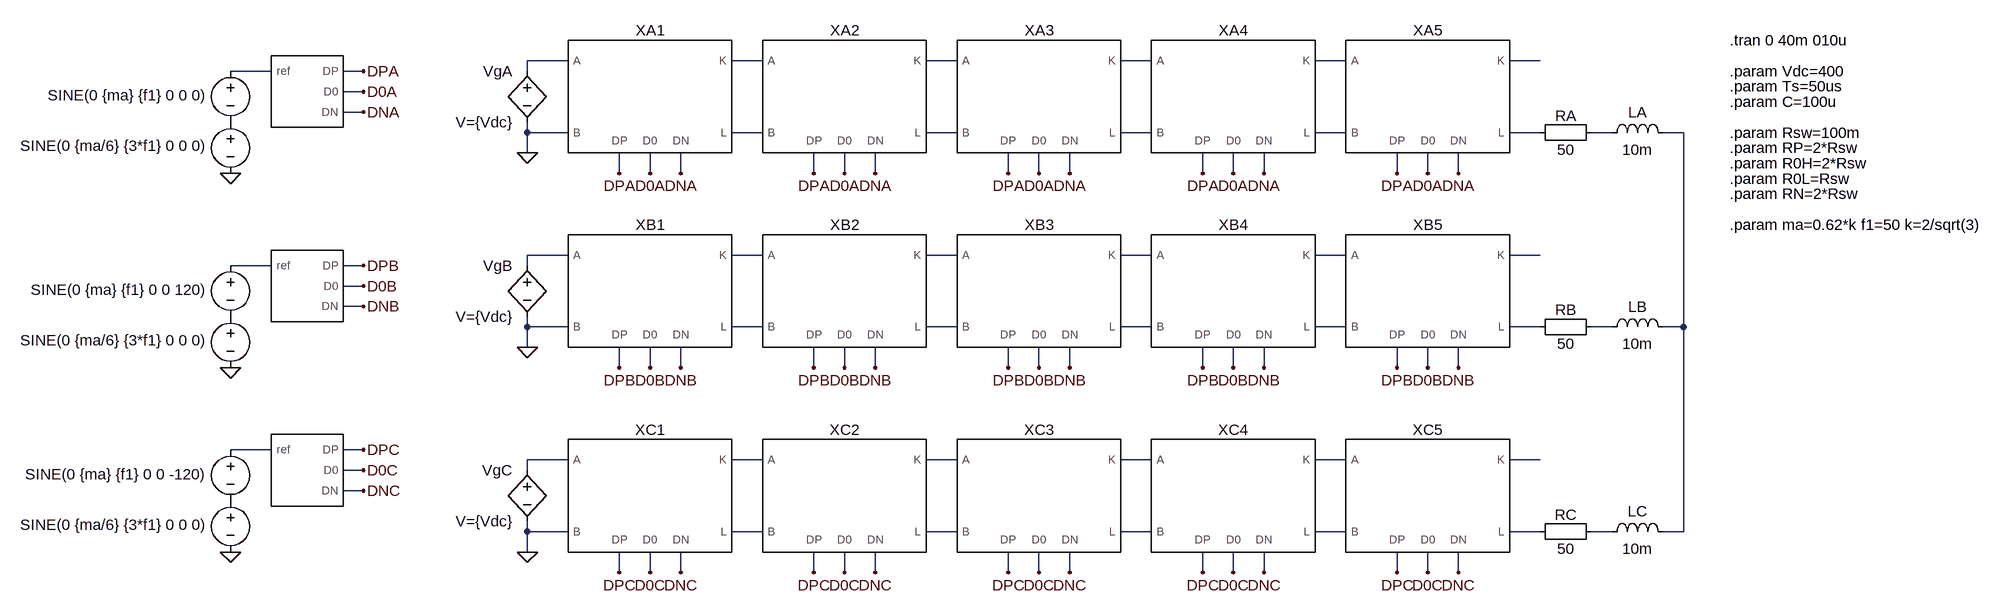
[diagram p0: schematic PN_voltage_drop_propagation.asc]
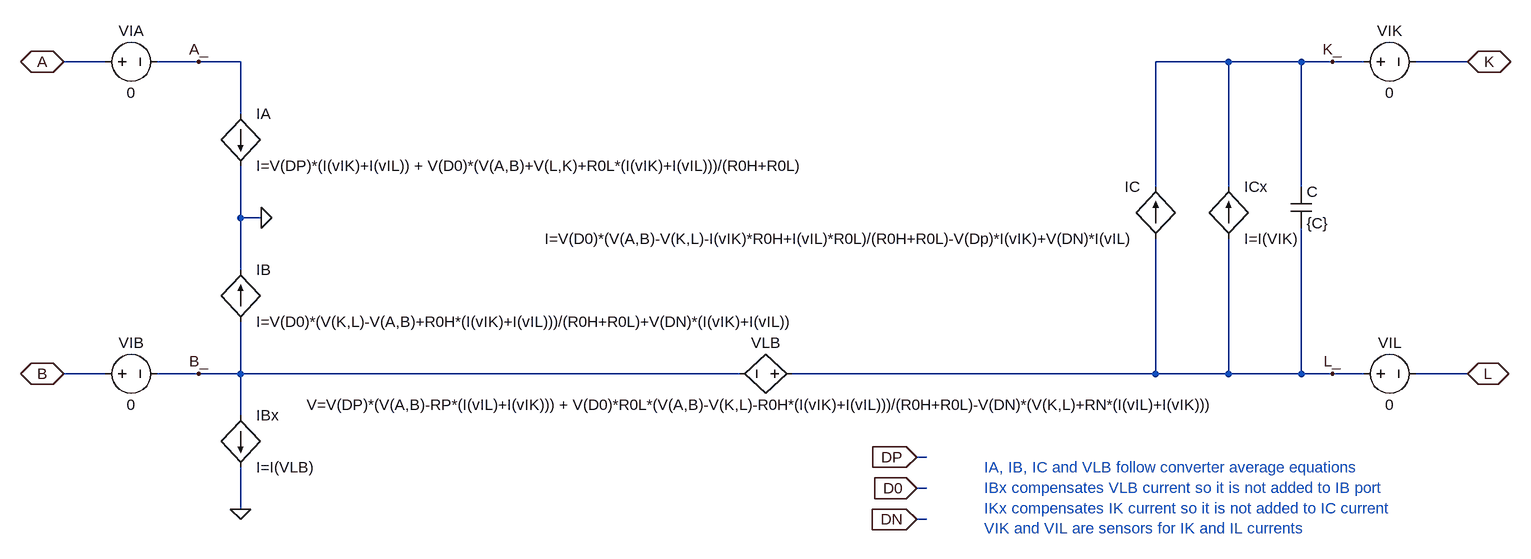
[diagram p1: sub-circuit pn_average_model.asc]
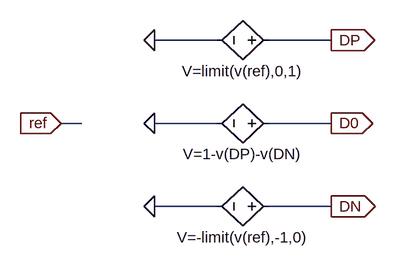
[diagram p2: sub-circuit pn_average_modulator.asc]
PN_voltage_drop_propagation.asc, the LTspice schematic file:
Version 4
SHEET 1 4356 1844
WIRE 1008 -1488 944 -1488
WIRE 1312 -1488 1264 -1488
WIRE 1616 -1488 1568 -1488
WIRE 1920 -1488 1872 -1488
WIRE 2224 -1488 2176 -1488
WIRE 2528 -1488 2480 -1488
WIRE 544 -1472 480 -1472
WIRE 688 -1472 656 -1472
WIRE 944 -1472 944 -1488
WIRE 688 -1440 656 -1440
WIRE 688 -1408 656 -1408
WIRE 944 -1376 944 -1392
WIRE 1008 -1376 944 -1376
WIRE 1312 -1376 1264 -1376
WIRE 1616 -1376 1568 -1376
WIRE 1920 -1376 1872 -1376
WIRE 2224 -1376 2176 -1376
WIRE 2528 -1376 2480 -1376
WIRE 2640 -1376 2608 -1376
WIRE 2752 -1376 2720 -1376
WIRE 944 -1344 944 -1376
WIRE 1088 -1312 1088 -1344
WIRE 1136 -1312 1136 -1344
WIRE 1184 -1312 1184 -1344
WIRE 1392 -1312 1392 -1344
WIRE 1440 -1312 1440 -1344
WIRE 1488 -1312 1488 -1344
WIRE 1696 -1312 1696 -1344
WIRE 1744 -1312 1744 -1344
WIRE 1792 -1312 1792 -1344
WIRE 2000 -1312 2000 -1344
WIRE 2048 -1312 2048 -1344
WIRE 2096 -1312 2096 -1344
WIRE 2304 -1312 2304 -1344
WIRE 2352 -1312 2352 -1344
WIRE 2400 -1312 2400 -1344
WIRE 1008 -1184 944 -1184
WIRE 1312 -1184 1264 -1184
WIRE 1616 -1184 1568 -1184
WIRE 1920 -1184 1872 -1184
WIRE 2224 -1184 2176 -1184
WIRE 2528 -1184 2480 -1184
WIRE 544 -1168 480 -1168
WIRE 688 -1168 656 -1168
WIRE 944 -1168 944 -1184
WIRE 688 -1136 656 -1136
WIRE 688 -1104 656 -1104
WIRE 944 -1072 944 -1088
WIRE 1008 -1072 944 -1072
WIRE 1312 -1072 1264 -1072
WIRE 1616 -1072 1568 -1072
WIRE 1920 -1072 1872 -1072
WIRE 2224 -1072 2176 -1072
WIRE 2528 -1072 2480 -1072
WIRE 2640 -1072 2608 -1072
WIRE 2752 -1072 2752 -1376
WIRE 2752 -1072 2720 -1072
WIRE 944 -1040 944 -1072
WIRE 1088 -1008 1088 -1040
WIRE 1136 -1008 1136 -1040
WIRE 1184 -1008 1184 -1040
WIRE 1392 -1008 1392 -1040
WIRE 1440 -1008 1440 -1040
WIRE 1488 -1008 1488 -1040
WIRE 1696 -1008 1696 -1040
WIRE 1744 -1008 1744 -1040
WIRE 1792 -1008 1792 -1040
WIRE 2000 -1008 2000 -1040
WIRE 2048 -1008 2048 -1040
WIRE 2096 -1008 2096 -1040
WIRE 2304 -1008 2304 -1040
WIRE 2352 -1008 2352 -1040
WIRE 2400 -1008 2400 -1040
WIRE 544 -880 480 -880
WIRE 688 -880 656 -880
WIRE 1008 -864 944 -864
WIRE 1312 -864 1264 -864
WIRE 1616 -864 1568 -864
WIRE 1920 -864 1872 -864
WIRE 2224 -864 2176 -864
WIRE 2528 -864 2480 -864
WIRE 688 -848 656 -848
WIRE 944 -848 944 -864
WIRE 688 -816 656 -816
WIRE 944 -752 944 -768
WIRE 1008 -752 944 -752
WIRE 1312 -752 1264 -752
WIRE 1616 -752 1568 -752
WIRE 1920 -752 1872 -752
WIRE 2224 -752 2176 -752
WIRE 2528 -752 2480 -752
WIRE 2640 -752 2608 -752
WIRE 2752 -752 2752 -1072
WIRE 2752 -752 2720 -752
WIRE 944 -720 944 -752
WIRE 1088 -688 1088 -720
WIRE 1136 -688 1136 -720
WIRE 1184 -688 1184 -720
WIRE 1392 -688 1392 -720
WIRE 1440 -688 1440 -720
WIRE 1488 -688 1488 -720
WIRE 1696 -688 1696 -720
WIRE 1744 -688 1744 -720
WIRE 1792 -688 1792 -720
WIRE 2000 -688 2000 -720
WIRE 2048 -688 2048 -720
WIRE 2096 -688 2096 -720
WIRE 2304 -688 2304 -720
WIRE 2352 -688 2352 -720
WIRE 2400 -688 2400 -720
FLAG 688 -1472 DPA
FLAG 688 -1440 D0A
FLAG 688 -1408 DNA
FLAG 1088 -1312 DPA
FLAG 1136 -1312 D0A
FLAG 1184 -1312 DNA
FLAG 944 -1344 0
FLAG 1088 -1008 DPB
FLAG 1136 -1008 D0B
FLAG 1184 -1008 DNB
FLAG 944 -1040 0
FLAG 1088 -688 DPC
FLAG 1136 -688 D0C
FLAG 1184 -688 DNC
FLAG 944 -720 0
FLAG 480 -1312 0
FLAG 1392 -1312 DPA
FLAG 1440 -1312 D0A
FLAG 1488 -1312 DNA
FLAG 1696 -1312 DPA
FLAG 1744 -1312 D0A
FLAG 1792 -1312 DNA
FLAG 688 -1168 DPB
FLAG 688 -1136 D0B
FLAG 688 -1104 DNB
FLAG 480 -1008 0
FLAG 688 -880 DPC
FLAG 688 -848 D0C
FLAG 688 -816 DNC
FLAG 480 -720 0
FLAG 1392 -1008 DPB
FLAG 1440 -1008 D0B
FLAG 1488 -1008 DNB
FLAG 1696 -1008 DPB
FLAG 1744 -1008 D0B
FLAG 1792 -1008 DNB
FLAG 1392 -688 DPC
FLAG 1440 -688 D0C
FLAG 1488 -688 DNC
FLAG 1696 -688 DPC
FLAG 1744 -688 D0C
FLAG 1792 -688 DNC
FLAG 2000 -1312 DPA
FLAG 2048 -1312 D0A
FLAG 2096 -1312 DNA
FLAG 2304 -1312 DPA
FLAG 2352 -1312 D0A
FLAG 2400 -1312 DNA
FLAG 2000 -1008 DPB
FLAG 2048 -1008 D0B
FLAG 2096 -1008 DNB
FLAG 2304 -1008 DPB
FLAG 2352 -1008 D0B
FLAG 2400 -1008 DNB
FLAG 2000 -688 DPC
FLAG 2048 -688 D0C
FLAG 2096 -688 DNC
FLAG 2304 -688 DPC
FLAG 2352 -688 D0C
FLAG 2400 -688 DNC
SYMBOL bv 944 -1488 M0
SYMATTR InstName VgA
SYMATTR Value V={Vdc}
SYMBOL Misc/EuropeanResistor 2512 -1360 R270
WINDOW 0 27 56 VTop 2
WINDOW 3 5 56 VBottom 2
SYMATTR InstName RA
SYMATTR Value 50
SYMBOL ind 2624 -1360 R270
WINDOW 0 32 56 VTop 2
WINDOW 3 5 56 VBottom 2
SYMATTR InstName LA
SYMATTR Value 10m
SYMBOL PN_average_model 1136 -1440 R0
SYMATTR InstName XA1
SYMATTR SpiceLine C={C} RP={RP} R0H={R0H} R0L={R0L} RN={RN}
SYMBOL PN_average_model 1440 -1440 R0
SYMATTR InstName XA2
SYMATTR SpiceLine C={C} RP={RP} R0H={R0H} R0L={R0L} RN={RN}
SYMBOL PN_average_model 1744 -1440 R0
SYMATTR InstName XA3
SYMATTR SpiceLine C={C} RP={RP} R0H={R0H} R0L={R0L} RN={RN}
SYMBOL bv 944 -1184 M0
SYMATTR InstName VgB
SYMATTR Value V={Vdc}
SYMBOL Misc/EuropeanResistor 2512 -1056 R270
WINDOW 0 27 56 VTop 2
WINDOW 3 5 56 VBottom 2
SYMATTR InstName RB
SYMATTR Value 50
SYMBOL ind 2624 -1056 R270
WINDOW 0 32 56 VTop 2
WINDOW 3 5 56 VBottom 2
SYMATTR InstName LB
SYMATTR Value 10m
SYMBOL PN_average_model 1136 -1136 R0
SYMATTR InstName XB1
SYMATTR SpiceLine C={C} RP={RP} R0H={R0H} R0L={R0L} RN={RN}
SYMBOL PN_average_model 1440 -1136 R0
SYMATTR InstName XB2
SYMATTR SpiceLine C={C} RP={RP} R0H={R0H} R0L={R0L} RN={RN}
SYMBOL PN_average_model 1744 -1136 R0
SYMATTR InstName XB3
SYMATTR SpiceLine C={C} RP={RP} R0H={R0H} R0L={R0L} RN={RN}
SYMBOL bv 944 -864 M0
SYMATTR InstName VgC
SYMATTR Value V={Vdc}
SYMBOL Misc/EuropeanResistor 2512 -736 R270
WINDOW 0 27 56 VTop 2
WINDOW 3 5 56 VBottom 2
SYMATTR InstName RC
SYMATTR Value 50
SYMBOL ind 2624 -736 R270
WINDOW 0 32 56 VTop 2
WINDOW 3 5 56 VBottom 2
SYMATTR InstName LC
SYMATTR Value 10m
SYMBOL PN_average_model 1136 -816 R0
SYMATTR InstName XC1
SYMATTR SpiceLine C={C} RP={RP} R0H={R0H} R0L={R0L} RN={RN}
SYMBOL PN_average_model 1440 -816 R0
SYMATTR InstName XC2
SYMATTR SpiceLine C={C} RP={RP} R0H={R0H} R0L={R0L} RN={RN}
SYMBOL PN_average_model 1744 -816 R0
SYMATTR InstName XC3
SYMATTR SpiceLine C={C} RP={RP} R0H={R0H} R0L={R0L} RN={RN}
SYMBOL voltage 480 -1488 M0
WINDOW 0 24 16 Invisible 2
WINDOW 3 39 54 Left 2
SYMATTR InstName V1
SYMATTR Value SINE(0 {ma} {f1} 0 0 0)
SYMBOL voltage 480 -1408 M0
WINDOW 0 24 16 Invisible 2
WINDOW 3 39 53 Left 2
SYMATTR InstName V2
SYMATTR Value SINE(0 {ma/6} {3*f1} 0 0 0)
SYMBOL voltage 480 -1184 M0
WINDOW 0 24 16 Invisible 2
WINDOW 3 39 54 Left 2
SYMATTR InstName V3
SYMATTR Value SINE(0 {ma} {f1} 0 0 120)
SYMBOL voltage 480 -1104 M0
WINDOW 0 24 16 Invisible 2
WINDOW 3 39 53 Left 2
SYMATTR InstName V4
SYMATTR Value SINE(0 {ma/6} {3*f1} 0 0 0)
SYMBOL voltage 480 -896 M0
WINDOW 0 24 16 Invisible 2
WINDOW 3 39 54 Left 2
SYMATTR InstName V5
SYMATTR Value SINE(0 {ma} {f1} 0 0 -120)
SYMBOL voltage 480 -816 M0
WINDOW 0 24 16 Invisible 2
WINDOW 3 39 53 Left 2
SYMATTR InstName V6
SYMATTR Value SINE(0 {ma/6} {3*f1} 0 0 0)
SYMBOL PN_average_modulator 592 -1440 R0
WINDOW 0 8 -56 Invisible 2
SYMATTR InstName X1
SYMBOL PN_average_modulator 592 -1136 R0
WINDOW 0 8 -56 Invisible 2
SYMATTR InstName X2
SYMBOL PN_average_modulator 592 -848 R0
WINDOW 0 8 -56 Invisible 2
SYMATTR InstName X3
SYMBOL PN_average_model 2048 -1440 R0
SYMATTR InstName XA4
SYMATTR SpiceLine C={C} RP={RP} R0H={R0H} R0L={R0L} RN={RN}
SYMBOL PN_average_model 2352 -1440 R0
SYMATTR InstName XA5
SYMATTR SpiceLine C={C} RP={RP} R0H={R0H} R0L={R0L} RN={RN}
SYMBOL PN_average_model 2048 -1136 R0
SYMATTR InstName XB4
SYMATTR SpiceLine C={C} RP={RP} R0H={R0H} R0L={R0L} RN={RN}
SYMBOL PN_average_model 2352 -1136 R0
SYMATTR InstName XB5
SYMATTR SpiceLine C={C} RP={RP} R0H={R0H} R0L={R0L} RN={RN}
SYMBOL PN_average_model 2048 -816 R0
SYMATTR InstName XC4
SYMATTR SpiceLine C={C} RP={RP} R0H={R0H} R0L={R0L} RN={RN}
SYMBOL PN_average_model 2352 -816 R0
SYMATTR InstName XC5
SYMATTR SpiceLine C={C} RP={RP} R0H={R0H} R0L={R0L} RN={RN}
TEXT 2824 -1448 Left 2 !.param Ts=50us
TEXT 2824 -1520 Left 2 !.tran 0 40m 010u
TEXT 2824 -1472 Left 2 !.param Vdc=400
TEXT 2824 -1232 Left 2 !.param ma=0.62*k f1=50 k=2/sqrt(3)
TEXT 2824 -1376 Left 2 !.param Rsw=100m
TEXT 2824 -1352 Left 2 !.param RP=2*Rsw
TEXT 2824 -1280 Left 2 !.param RN=2*Rsw
TEXT 2824 -1328 Left 2 !.param R0H=2*Rsw
TEXT 2824 -1304 Left 2 !.param R0L=Rsw
TEXT 2824 -1424 Left 2 !.param C=100u

pn_average_model.asc, the sub-circuit schematic file:
Version 4
SHEET 1 2060 780
WIRE -720 16 -784 16
WIRE -576 16 -640 16
WIRE -512 16 -576 16
WIRE 1008 16 896 16
WIRE 1120 16 1008 16
WIRE 1168 16 1120 16
WIRE 1216 16 1168 16
WIRE 1376 16 1296 16
WIRE -512 96 -512 16
WIRE 896 208 896 16
WIRE 1008 208 1008 16
WIRE 1120 208 1120 16
WIRE -512 256 -512 176
WIRE -480 256 -512 256
WIRE -512 336 -512 256
WIRE -720 496 -784 496
WIRE -576 496 -640 496
WIRE -512 496 -512 416
WIRE -512 496 -576 496
WIRE 256 496 -512 496
WIRE 896 496 896 288
WIRE 896 496 336 496
WIRE 1008 496 1008 288
WIRE 1008 496 896 496
WIRE 1120 496 1120 272
WIRE 1120 496 1008 496
WIRE 1168 496 1120 496
WIRE 1216 496 1168 496
WIRE 1376 496 1296 496
WIRE -512 560 -512 496
WIRE 544 624 528 624
WIRE 544 672 528 672
WIRE -512 704 -512 640
WIRE 544 720 528 720
FLAG 1376 16 K
IOPIN 1376 16 BiDir
FLAG 1376 496 L
IOPIN 1376 496 BiDir
FLAG -784 16 A
IOPIN -784 16 BiDir
FLAG -784 496 B
IOPIN -784 496 BiDir
FLAG 528 624 DP
IOPIN 528 624 In
FLAG 528 672 D0
IOPIN 528 672 In
FLAG 528 720 DN
IOPIN 528 720 In
FLAG -480 256 0
FLAG -512 704 0
FLAG -576 16 A_
FLAG -576 496 B_
FLAG 1168 16 K_
FLAG 1168 496 L_
SYMBOL bv 352 496 R90
WINDOW 0 -32 56 VBottom 2
WINDOW 3 32 56 VTop 2
SYMATTR InstName VLB
SYMATTR Value V=V(DP)*(V(A,B)-RP*(I(vIL)+I(vIK))) + V(D0)*R0L*(V(A,B)-V(K,L)-R0H*(I(vIK)+I(vIL)))/(R0H+R0L)-V(DN)*(V(K,L)+RN*(I(vIL)+I(vIK)))
SYMBOL bi -512 96 R0
SYMATTR InstName IA
SYMATTR Value I=V(DP)*(I(vIK)+I(vIL)) + V(D0)*(V(A,B)+V(L,K)+R0L*(I(vIK)+I(vIL)))/(R0H+R0L)
SYMBOL cap 1104 208 R0
SYMATTR InstName C
SYMATTR Value {C}
SYMBOL bi 896 288 R180
WINDOW 0 24 80 Left 2
WINDOW 3 24 0 Left 2
SYMATTR InstName IC
SYMATTR Value I=V(D0)*(V(A,B)-V(K,L)-I(vIK)*R0H+I(vIL)*R0L)/(R0H+R0L)-V(Dp)*I(vIK)+V(DN)*I(vIL)
SYMBOL bi -512 416 M180
WINDOW 0 24 80 Left 2
WINDOW 3 24 0 Left 2
SYMATTR InstName IB
SYMATTR Value I=V(D0)*(V(K,L)-V(A,B)+R0H*(I(vIK)+I(vIL)))/(R0H+R0L)+V(DN)*(I(vIK)+I(vIL))
SYMBOL voltage 1200 496 R270
WINDOW 0 32 56 VTop 2
WINDOW 3 -32 56 VBottom 2
SYMATTR InstName VIL
SYMATTR Value 0
SYMBOL voltage 1200 16 R270
WINDOW 0 32 56 VTop 2
WINDOW 3 -32 56 VBottom 2
SYMATTR InstName VIK
SYMATTR Value 0
SYMBOL bi -512 560 R0
SYMATTR InstName IBx
SYMATTR Value I=I(VLB)
SYMBOL bi 1008 288 M180
WINDOW 0 24 80 Left 2
WINDOW 3 24 0 Left 2
SYMATTR InstName ICx
SYMATTR Value I=I(VIK)
SYMBOL voltage -736 496 R270
WINDOW 0 32 56 VTop 2
WINDOW 3 -32 56 VBottom 2
SYMATTR InstName VIB
SYMATTR Value 0
SYMBOL voltage -736 16 R270
WINDOW 0 32 56 VTop 2
WINDOW 3 -32 56 VBottom 2
SYMATTR InstName VIA
SYMATTR Value 0
TEXT 632 640 Left 2 ;IA, IB, IC and VLB follow converter average equations\nIBx compensates VLB current so it is not added to IB port\nIKx compensates IK current so it is not added to IC current\nVIK and VIL are sensors for IK and IL currents

pn_average_modulator.asc, the sub-circuit schematic file:
Version 4
SHEET 1 880 680
WIRE 304 160 208 160
WIRE 480 160 384 160
WIRE 96 288 64 288
WIRE 304 288 208 288
WIRE 480 288 384 288
WIRE 304 416 208 416
WIRE 480 416 384 416
FLAG 208 160 0
FLAG 208 288 0
FLAG 208 416 0
FLAG 480 160 DP
IOPIN 480 160 Out
FLAG 480 288 D0
IOPIN 480 288 Out
FLAG 480 416 DN
IOPIN 480 416 Out
FLAG 64 288 ref
IOPIN 64 288 In
SYMBOL bv 400 160 R90
WINDOW 0 -32 56 Invisible 2
WINDOW 3 32 56 VTop 2
SYMATTR InstName Bpos1
SYMATTR Value V=limit(v(ref),0,1)
SYMBOL bv 400 288 R90
WINDOW 0 -32 56 Invisible 2
WINDOW 3 32 56 VTop 2
SYMATTR InstName Bzero1
SYMATTR Value V=1-v(DP)-v(DN)
SYMBOL bv 400 416 R90
WINDOW 0 -32 56 Invisible 2
WINDOW 3 32 56 VTop 2
SYMATTR InstName Bneg1
SYMATTR Value V=-limit(v(ref),-1,0)

The netlist it stands for:
* PN_voltage_drop_propagation.asc
B§VgA N001 0 V={Vdc}
RA N012 N013 50
LA N013 N014 10m
XXA1 D0A DNA DPA N001 0 N002 N008 pn_average_model params: C={C} RP={RP} R0H={R0H} R0L={R0L} RN={RN}
XXA2 D0A DNA DPA N002 N008 N003 N009 pn_average_model params: C={C} RP={RP} R0H={R0H} R0L={R0L} RN={RN}
XXA3 D0A DNA DPA N003 N009 N004 N010 pn_average_model params: C={C} RP={RP} R0H={R0H} R0L={R0L} RN={RN}
B§VgB N015 0 V={Vdc}
RB N026 N027 50
LB N027 N014 10m
XXB1 D0B DNB DPB N015 0 N016 N022 pn_average_model params: C={C} RP={RP} R0H={R0H} R0L={R0L} RN={RN}
XXB2 D0B DNB DPB N016 N022 N017 N023 pn_average_model params: C={C} RP={RP} R0H={R0H} R0L={R0L} RN={RN}
XXB3 D0B DNB DPB N017 N023 N018 N024 pn_average_model params: C={C} RP={RP} R0H={R0H} R0L={R0L} RN={RN}
B§VgC N029 0 V={Vdc}
RC N039 N040 50
LC N040 N014 10m
XXC1 D0C DNC DPC N029 0 N030 N035 pn_average_model params: C={C} RP={RP} R0H={R0H} R0L={R0L} RN={RN}
XXC2 D0C DNC DPC N030 N035 N031 N036 pn_average_model params: C={C} RP={RP} R0H={R0H} R0L={R0L} RN={RN}
XXC3 D0C DNC DPC N031 N036 N032 N037 pn_average_model params: C={C} RP={RP} R0H={R0H} R0L={R0L} RN={RN}
V1 N007 P001 SINE(0 {ma} {f1} 0 0 0)
V2 P001 0 SINE(0 {ma/6} {3*f1} 0 0 0)
V3 N021 P002 SINE(0 {ma} {f1} 0 0 120)
V4 P002 0 SINE(0 {ma/6} {3*f1} 0 0 0)
V5 N028 P003 SINE(0 {ma} {f1} 0 0 -120)
V6 P003 0 SINE(0 {ma/6} {3*f1} 0 0 0)
XX1 N007 D0A DNA DPA pn_average_modulator
XX2 N021 D0B DNB DPB pn_average_modulator
XX3 N028 D0C DNC DPC pn_average_modulator
XXA4 D0A DNA DPA N004 N010 N005 N011 pn_average_model params: C={C} RP={RP} R0H={R0H} R0L={R0L} RN={RN}
XXA5 D0A DNA DPA N005 N011 N006 N012 pn_average_model params: C={C} RP={RP} R0H={R0H} R0L={R0L} RN={RN}
XXB4 D0B DNB DPB N018 N024 N019 N025 pn_average_model params: C={C} RP={RP} R0H={R0H} R0L={R0L} RN={RN}
XXB5 D0B DNB DPB N019 N025 N020 N026 pn_average_model params: C={C} RP={RP} R0H={R0H} R0L={R0L} RN={RN}
XXC4 D0C DNC DPC N032 N037 N033 N038 pn_average_model params: C={C} RP={RP} R0H={R0H} R0L={R0L} RN={RN}
XXC5 D0C DNC DPC N033 N038 N034 N039 pn_average_model params: C={C} RP={RP} R0H={R0H} R0L={R0L} RN={RN}

* block symbol definitions
.subckt pn_average_model D0 DN DP A B K L
B§VLB L_ B_ V=V(DP)*(V(A,B)-RP*(I(vIL)+I(vIK))) + V(D0)*R0L*(V(A,B)-V(K,L)-R0H*(I(vIK)+I(vIL)))/(R0H+R0L)-V(DN)*(V(K,L)+RN*(I(vIL)+I(vIK)))
B§IA A_ 0 I=V(DP)*(I(vIK)+I(vIL)) + V(D0)*(V(A,B)+V(L,K)+R0L*(I(vIK)+I(vIL)))/(R0H+R0L)
C K_ L_ {C}
B§IC L_ K_ I=V(D0)*(V(A,B)-V(K,L)-I(vIK)*R0H+I(vIL)*R0L)/(R0H+R0L)-V(Dp)*I(vIK)+V(DN)*I(vIL)
B§IB B_ 0 I=V(D0)*(V(K,L)-V(A,B)+R0H*(I(vIK)+I(vIL)))/(R0H+R0L)+V(DN)*(I(vIK)+I(vIL))
VIL L_ L 0
VIK K_ K 0
B§IBx B_ 0 I=I(VLB)
B§ICx L_ K_ I=I(VIK)
VIB B B_ 0
VIA A A_ 0
* IA, IB, IC and VLB follow converter average equations
* IBx compensates VLB current so it is not added to IB port
* IKx compensates IK current so it is not added to IC current
* VIK and VIL are sensors for IK and IL currents
.ends pn_average_model

.subckt pn_average_modulator ref D0 DN DP
Bpos1 DP 0 V=limit(v(ref),0,1)
Bzero1 D0 0 V=1-v(DP)-v(DN)
Bneg1 DN 0 V=-limit(v(ref),-1,0)
.ends pn_average_modulator

.param Ts=50us
.tran 0 40m 010u
.param Vdc=400
.param ma=0.62*k f1=50 k=2/sqrt(3)
.param Rsw=100m
.param RP=2*Rsw
.param RN=2*Rsw
.param R0H=2*Rsw
.param R0L=Rsw
.param C=100u
.backanno
.end